# Altium schematic sheet SIM4G.SchDoc: =ProjectName
size A3; Author: Ven
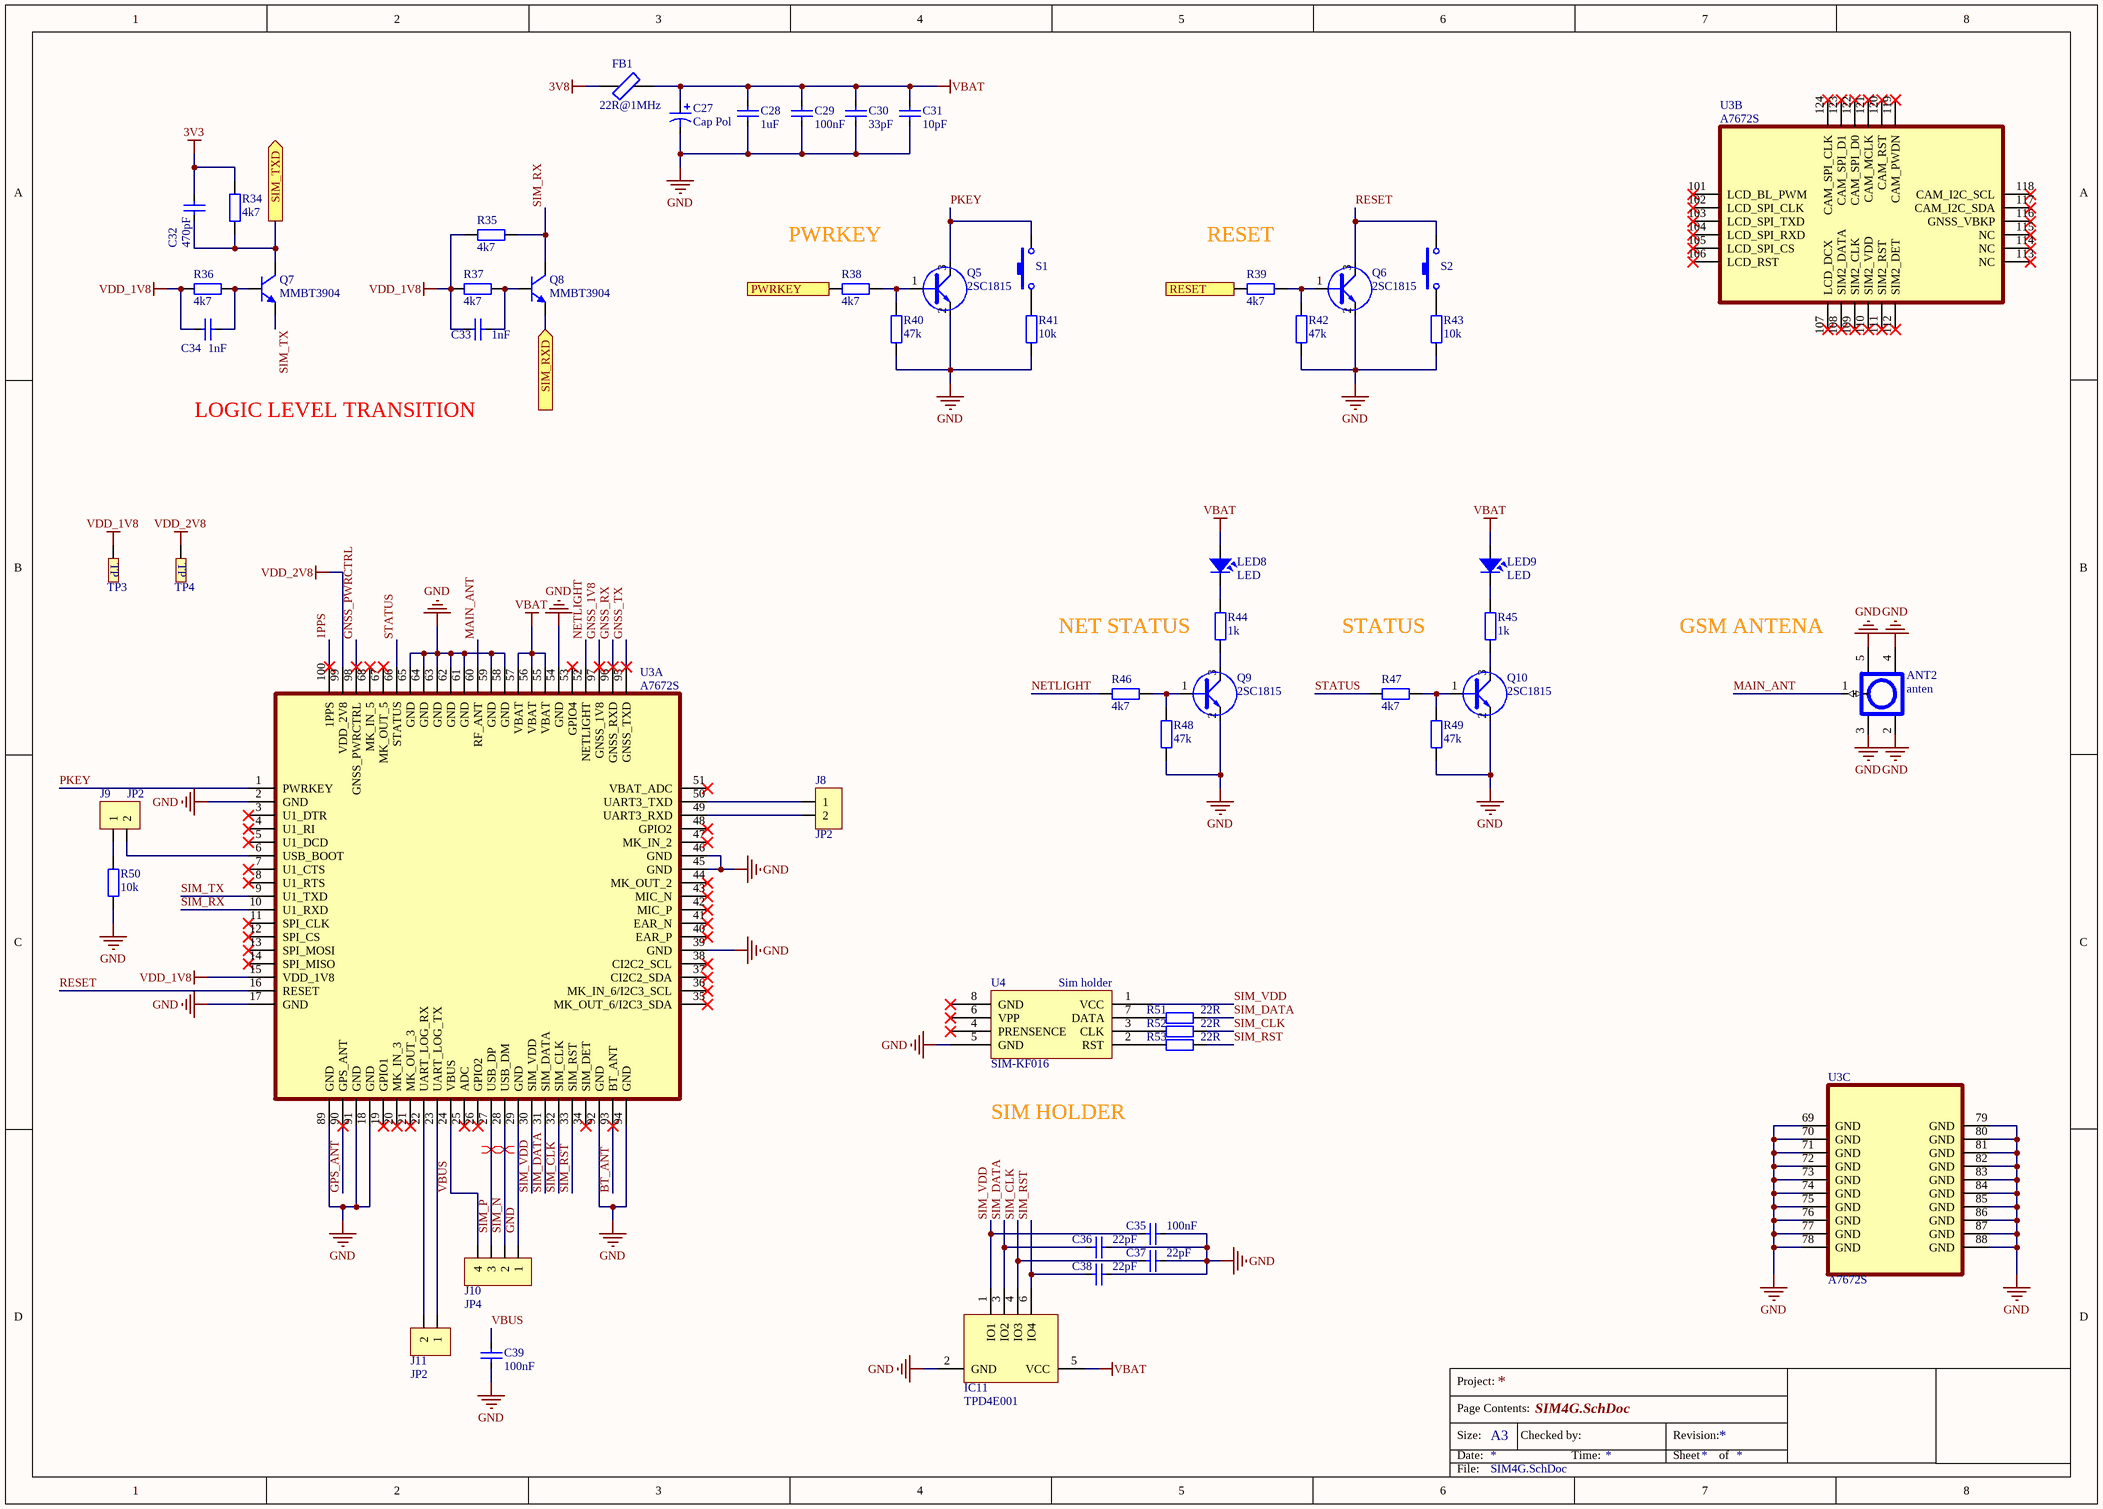
[diagram p0: SIM4G.SchDoc]

## Parts
ANT2  anten  [SMA-RA]
C27  Cap Pol  [CAP_7343]
C28  1uF  [CAP_0805]
C29  100nF  [CAP_0805]
C30  33pF  [CAP_0805]
C31  10pF  [CAP_0805]
C32  470pF  [CAP_0805]
C33  1nF  [CAP_0805]
C34  1nF  [CAP_0805]
C35  100nF  [CAP_0805]
C36  22pF  [CAP_0805]
C37  22pF  [CAP_0805]
C38  22pF  [CAP_0805]
C39  100nF  [CAP_0805]
FB1  22R@1MHz  [RES-SMD-0805]
IC11  TPD4E001  [SOT23-6]
J8  JP2  [JP2-C1T]
J9  JP2  [JP2-CLOSED]
J10  JP4  [Header4 - SMD 1.25mm - B]
J11  JP2  [JP2-C1T]
LED8  LED  [LED-0805-Orange]
LED9  LED  [LED-0805-Orange]
Q5  2SC1815  [SOT23D]
Q6  2SC1815  [SOT23D]
Q7  MMBT3904  [MMBT3904]
Q8  MMBT3904  [MMBT3904]
Q9  2SC1815  [SOT23D]
Q10  2SC1815  [SOT23D]
R34  4k7  [RES-SMD-0805]
R35  4k7  [RES-SMD-0805]
R36  4k7  [RES-SMD-0805]
R37  4k7  [RES-SMD-0805]
R38  4k7  [RES-SMD-0805]
R39  4k7  [RES-SMD-0805]
R40  47k  [RES-SMD-0805]
R41  10k  [RES-SMD-0805]
R42  47k  [RES-SMD-0805]
R43  10k  [RES-SMD-0805]
R44  1k  [RES-SMD-0805]
R45  1k  [RES-SMD-0805]
R46  4k7  [RES-SMD-0805]
R47  4k7  [RES-SMD-0805]
R48  47k  [RES-SMD-0805]
R49  47k  [RES-SMD-0805]
R50  10k  [RES-SMD-0805]
R51  22R  [RES-SMD-0805]
R52  22R  [RES-SMD-0805]
R53  22R  [RES-SMD-0805]
S1  SW-SMD  [SW 3x2x4]  (value not drawn)
S2  SW-SMD  [SW 3x2x4]  (value not drawn)
TP3  TEST POINT  [TP_SMD]  (value not drawn)
TP4  TEST POINT  [TP_SMD]  (value not drawn)
U3  A7672S  [A7672S]  (parts A,B,C of 3)
U4  SIM-KF016  value Sim holder  [Sim Socket]

## Ports
PWRKEY (in), RESET (in), SIM_RXD (in), SIM_TXD (out)

## Nets
3V3: C32.2 R34.1
3V8: FB1.1
GND: ANT2.2 ANT2.3 ANT2.4 ANT2.5 C27.2 C28.1 C29.1 C30.1 C31.1 C35.2 C36.2 C37.2 C38.1 C39.1 IC11.2(GND) J10.1 Q5.2(E) Q6.2(E) Q9.2(E) Q10.2(E) R40.2 R41.2 R42.2 R43.2 R48.1 R49.1 R50.2 U3.2(GND) U3.17(GND) U3.18(GND) U3.29(GND) U3.39(GND) U3.45(GND) U3.46(GND) U3.54(GND) U3.58(GND) U3.59(GND) U3.61(GND) U3.62(GND) U3.63(GND) U3.64(GND) U3.65(GND) U3.69(GND) U3.70(GND) U3.71(GND) U3.72(GND) U3.73(GND) U3.74(GND) U3.75(GND) U3.76(GND) U3.77(GND) U3.78(GND) U3.79(GND) U3.80(GND) U3.81(GND) U3.82(GND) U3.83(GND) U3.84(GND) U3.85(GND) U3.86(GND) U3.87(GND) U3.88(GND) U3.89(GND) U3.91(GND) U3.92(GND) U3.94(GND) U4.5(GND)
VBAT: C27.1 C28.2 C29.2 C30.2 C31.2 FB1.2 IC11.5(VCC) LED8.1 LED9.1 U3.55(VBAT) U3.56(VBAT) U3.57(VBAT)
VDD_1V8: C33.1 C34.1 R35.1 R36.2 R37.2 TP3.1 U3.15(VDD_1V8)
VDD_2V8: TP4.1 U3.99(VDD_2V8)
1PPS: U3.100(1PPS)
BT_ANT: U3.93(BT_ANT)
GNSS_1V8: U3.97(GNSS_1V8)
GNSS_PWRCTRL: U3.98(GNSS_PWRCTRL)
GNSS_RX: U3.96(GNSS_RXD)
GNSS_TX: U3.95(GNSS_TXD)
GPS_ANT: U3.90(GPS_ANT)
MAIN_ANT: ANT2.1 U3.60(RF_ANT)
NETLIGHT: R46.1 U3.52(NETLIGHT)
PKEY: Q5.3(C) S1.2 U3.1(PWRKEY)
PWRKEY: R38.2 ; port PWRKEY
RESET: Q6.3(C) S2.2 U3.16(RESET)
RESET: R39.2 ; port RESET  [a separate net that carries the same name]
SIM_CLK: C37.1 IC11.4(IO3) R52.1 U3.32(SIM_CLK)
SIM_DATA: C36.1 IC11.3(IO2) R51.1 U3.31(SIM_DATA)
SIM_N: J10.2 U3.28(USB_DM)
SIM_P: J10.3 U3.27(USB_DP)
SIM_RST: C38.2 IC11.6(IO4) R53.1 U3.33(SIM_RST)
SIM_RX: Q8.3(C) R35.2 U3.10(U1_RXD)
SIM_RXD: Q8.2(E) ; port SIM_RXD
SIM_TX: Q7.2(E) U3.9(U1_TXD)
SIM_TXD: C32.1 Q7.3(C) R34.2 ; port SIM_TXD
SIM_VDD: C35.1 IC11.1(IO1) U3.30(SIM_VDD) U4.1(VCC)
STATUS: R47.1 U3.66(STATUS)
VBUS: C39.2 J10.4 U3.24(VBUS)
NetC33_2: C33.2 Q8.1(B) R37.1
NetC34_2: C34.2 Q7.1(B) R36.1
NetJ8_1: J8.1 U3.50(UART3_TXD)
NetJ8_2: J8.2 U3.49(UART3_RXD)
NetJ9_1: J9.1 R50.1
NetJ9_2: J9.2 U3.6(USB_BOOT)
NetJ11_1: J11.1 U3.23(UART_LOG_TX)
NetJ11_2: J11.2 U3.22(UART_LOG_RX)
NetLED8_2: LED8.2 R44.2
NetLED9_2: LED9.2 R45.2
NetQ5_1: Q5.1(B) R38.1 R40.1
NetQ6_1: Q6.1(B) R39.1 R42.1
NetQ9_1: Q9.1(B) R46.2 R48.2
NetQ9_3: Q9.3(C) R44.1
NetQ10_1: Q10.1(B) R47.2 R49.2
NetQ10_3: Q10.3(C) R45.1
NetR41_1: R41.1 S1.1
NetR43_1: R43.1 S2.1
NetR51_2: R51.2 U4.7(DATA)
NetR52_2: R52.2 U4.3(CLK)
NetR53_2: R53.2 U4.2(RST)

Not connected (* = marked no-connect by the designer): U3 3(U1_DTR)* 4(U1_RI)* 5(U1_DCD)* 7(U1_CTS)* 8(U1_RTS)* 11(SPI_CLK)* 12(SPI_CS)* 13(SPI_MOSI)* 14(SPI_MISO)* 19(GPIO1)* 20(MK_IN_3)* 21(MK_OUT_3)* 25(ADC)* 26(GPIO2)* 34(SIM_DET)* 35(MK_OUT_6/I2C3_SDA)* 36(MK_IN_6/I2C3_SCL)* 37(CI2C2_SDA)* 38(CI2C2_SCL)* 40(EAR_P)* 41(EAR_N)* 42(MIC_P)* 43(MIC_N)* 44(MK_OUT_2)* 47(MK_IN_2)* 48(GPIO2)* 51(VBAT_ADC)* 53(GPIO4)* 67(MK_OUT_5)* 68(MK_IN_5)* 101(LCD_BL_PWM)* 102(LCD_SPI_CLK)* 103(LCD_SPI_TXD)* 104(LCD_SPI_RXD)* 105(LCD_SPI_CS)* 106(LCD_RST)* 107(LCD_DCX)* 108(SIM2_DATA)* 109(SIM2_CLK)* 110(SIM2_VDD)* 111(SIM2_RST)* 112(SIM2_DET)* 113(NC)* 114(NC)* 115(NC)* 116(GNSS_VBKP)* 117(CAM_I2C_SDA)* 118(CAM_I2C_SCL)* 119(CAM_PWDN)* 120(CAM_RST)* 121(CAM_MCLK)* 122(CAM_SPI_D0)* 123(CAM_SPI_D1)* 124(CAM_SPI_CLK)*; U4 4(PRENSENCE)* 6(VPP)* 8(GND)*

## Layout directives
differential pair: SIM_N, SIM_P

## Notes on the sheet
- (near R38) PWRKEY
- (near R39) RESET
- LOGIC LEVEL TRANSITION
- NET STATUS
- STATUS
- GSM ANTENA
- SIM HOLDER
- Project:
- Page Contents:
- Size:
- Date:
- A3
- Checked by:
- Time:
- Revision:
- Sheet
- of
- File:

## Library data of the parts
C27 = Cap Pol: Polarized Capacitor (Axial); Published: 8-Jun-2000; LatestRevisionDate: 17-Jul-2002; LatestRevisionNote: Re-released for DXP Platform.; PackageReference: POLAR0.8; Publisher: Altium Limited
C28-C39 = CapSMD: Capacitor; Value: 33p; Published: 8-Jun-2000; LatestRevisionDate: 17-Jul-2002; LatestRevisionNote: Re-released for DXP Platform.; PackageReference: RAD-0.3; Publisher: Altium Limited
FB1 = Ferrit Bead: Generic Ferrit Bead
J8 J9 J11 = JP2: WR-PHD 2.54 mm Angled Socket Header; Manufacturer: W¨¹rth Elektronik eiSos GmbH; partNo: 613002143121; ComponentLink1 Description: Manufacturer; ComponentLink2 Description: Datasheet; NoPins: 02; Created Date: 29 March 2013; ComponentLink1URL: http://www.we-online.com; ComponentLink2URL: http://katalog.we-online.de/em/datasheet/6130xx143121.pdf; Created by: Karrer Zheng
J10 = JP4: WR-PHD 2.54 mm Angled Socket Header; Manufacturer: W¨¹rth Elektronik eiSos GmbH; partNo: 613004143121; ComponentLink1 Description: Manufacturer; ComponentLink2 Description: Datasheet; NoPins: 04; Created Date: 29 March 2013; ComponentLink1URL: http://www.we-online.com; ComponentLink2URL: http://katalog.we-online.de/em/datasheet/6130xx143121.pdf; Created by: Karrer Zheng
LED8 LED9 = LED: LED Single colour Green and Red; Value: LED 3 ly Single Colour
Q5 Q6 Q9 Q10 = C1815: NPN 600mW, ECB; Value: C1815
Q7 Q8 = MMBT3904: NPN transitor
R34-R53 = Resistor - SMD: Resistor SMD; Manufacturer: Generic Components; Class: Passive; Published: 08/06/2000; Publisher: Altium Hobart Technology Centre
S1 S2 = SW-SMD: Switch; Published: 24-Mar-1999; LatestRevisionDate: 17-Jul-2002; LatestRevisionNote: Re-released for DXP Platform.; PackageReference: SPST-2; Publisher: Altium Limited
TP3 TP4 = TP
U4 = Sim holder: SIM Card Holder KF-016